# EAGLE design pcb (EAGLE 9.6.0)
Assembly variants: lowcost_cap, lowcost_battery
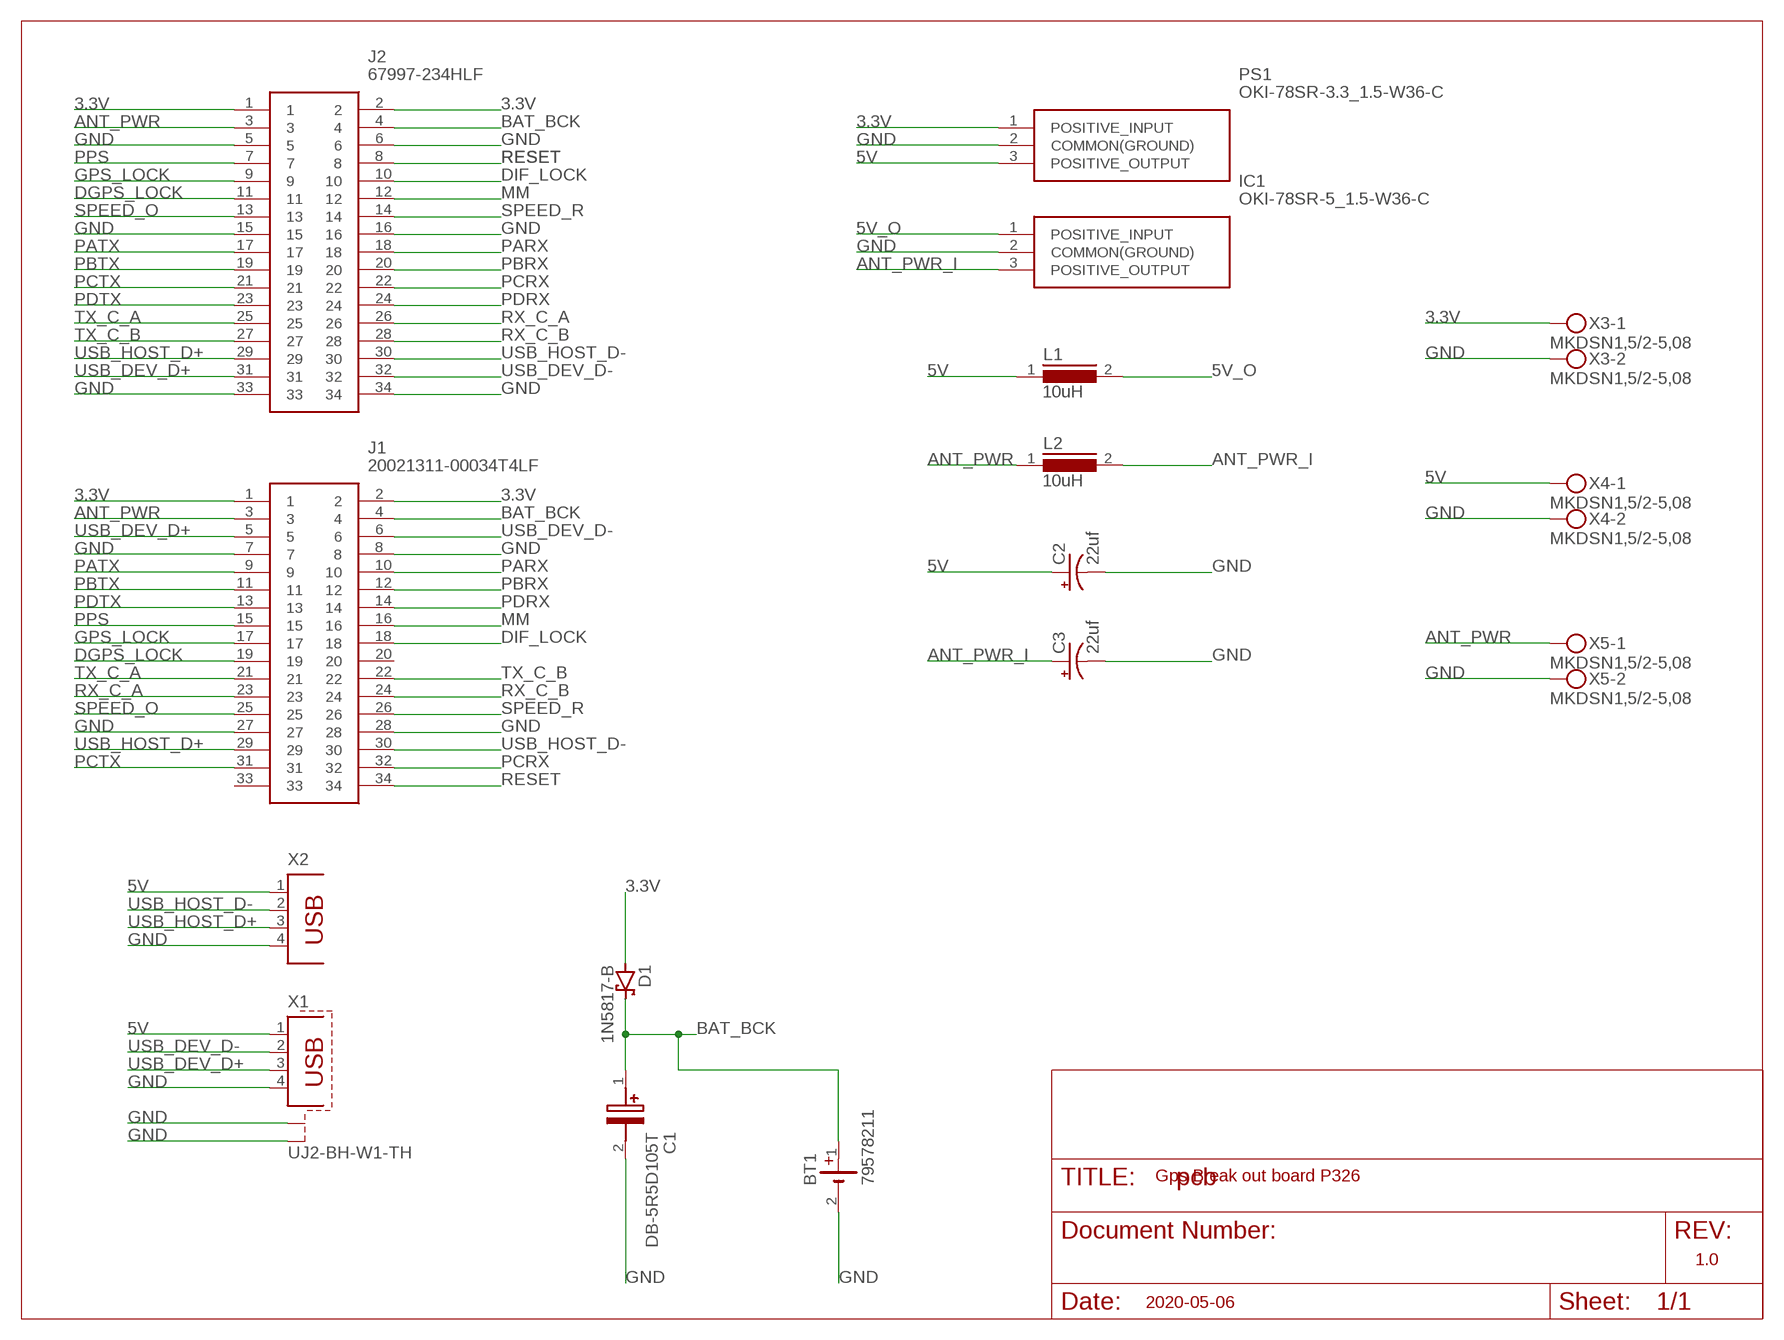
[diagram p0: schematic, sheet 1]

## Parts
BT1  79578211  [79578211]  (not fitted in variant lowcost_cap)
C1  DB-5R5D105T  [CAPPRD500W130D2150H800]  (not fitted in variant lowcost_battery)
C2  22uf  C-POL-US_RADIAL-11MM-DIA  [CAPPRD508W65D1000H1100B]  (not fitted in variant lowcost_cap)  (not fitted in variant lowcost_battery)
C3  22uf  C-POL-US_RADIAL-11MM-DIA  [CAPPRD508W65D1000H1100B]  (not fitted in variant lowcost_cap)  (not fitted in variant lowcost_battery)
D1  1N5817-B  [DO41-7.6]  (not fitted in variant lowcost_battery)
IC1  OKI-78SR-5_1.5-W36-C  [OKI-78SR]  (not fitted in variant lowcost_cap)  (not fitted in variant lowcost_battery)
J1  20021311-00034T4LF  SFMC-117-01-L-D-K  [SFMC11701LDK]
J2  67997-234HLF  TSW-117-07-L-D  [HDRV34W64P254_2X17_4318X495X83]
L1  10uH  82114R  [82114R]  (not fitted in variant lowcost_cap)  (not fitted in variant lowcost_battery)
L2  10uH  82114R  [82114R]  (not fitted in variant lowcost_cap)  (not fitted in variant lowcost_battery)
PS1  OKI-78SR-3.3_1.5-W36-C  OKI-78SR-5_1.5-W36-C  [OKI-78SR]  (not fitted in variant lowcost_cap)  (not fitted in variant lowcost_battery)
X1  UJ2-BH-W1-TH  PN61729-S  [PN61729-S]  (not fitted in variant lowcost_cap)  (not fitted in variant lowcost_battery)
X2  PN87520  [PN87520]  (not fitted in variant lowcost_cap)  (not fitted in variant lowcost_battery)
X3  MKDSN1,5/2-5,08  [MKDSN1,5/2-5,08]  (not fitted in variant lowcost_cap)  (not fitted in variant lowcost_battery)
X4  MKDSN1,5/2-5,08  [MKDSN1,5/2-5,08]  (not fitted in variant lowcost_cap)  (not fitted in variant lowcost_battery)
X5  MKDSN1,5/2-5,08  [MKDSN1,5/2-5,08]  (not fitted in variant lowcost_cap)  (not fitted in variant lowcost_battery)

## Nets
3.3V: D1.A J1.1 J1.2 J2.1 J2.2 PS1.1(POSITIVE_INPUT) X3.1
5V: C2.1(+) L1.1 PS1.3(POSITIVE_OUTPUT) X1.1 X2.1 X4.1
5V_O: IC1.1(POSITIVE_INPUT) L1.2
ANT_PWR: J1.3 J2.3 L2.1 X5.1
ANT_PWR_I: C3.1(+) IC1.3(POSITIVE_OUTPUT) L2.2
BAT_BCK: BT1.1(+) C1.1(+) D1.C J1.4 J2.4
DGPS_LOCK: J1.19 J2.11
DIF_LOCK: J1.18 J2.10
GND: BT1.2(-) C1.2(-) C2.2(-) C3.2(-) IC1.2(COMMON(GROUND)) J1.7 J1.8 J1.27 J1.28 J2.5 J2.6 J2.15 J2.16 J2.33 J2.34 PS1.2(COMMON(GROUND)) X1.4 X1.S1 X1.S2 X2.4 X3.2 X4.2 X5.2
GPS_LOCK: J1.17 J2.9
MM: J1.16 J2.12
PARX: J1.10 J2.18
PATX: J1.9 J2.17
PBRX: J1.12 J2.20
PBTX: J1.11 J2.19
PCRX: J1.32 J2.22
PCTX: J1.31 J2.21
PDRX: J1.14 J2.24
PDTX: J1.13 J2.23
PPS: J1.15 J2.7
RESET: J1.34 J2.8
RX_C_A: J1.23 J2.26
RX_C_B: J1.24 J2.28
SPEED_O: J1.25 J2.13
SPEED_R: J1.26 J2.14
TX_C_A: J1.21 J2.25
TX_C_B: J1.22 J2.27
USB_DEV_D+: J1.5 J2.31 X1.3
USB_DEV_D-: J1.6 J2.32 X1.2
USB_HOST_D+: J1.29 J2.29 X2.3
USB_HOST_D-: J1.30 J2.30 X2.2
Unconnected: J1.20 J1.33

## Notes on the sheet
- Gps Break out board P326
- 1.0
- 2020-05-06

## Library data of the parts
BT1 = Battery Holder:79578211: BATTERY HOLDER COIN PC PIN Manufacturer's datasheet <https://katalog.we-online.de/em/datasheet/79578211.pdf>; CREATED_BY: PCBLayout.com; DIGIKEY_PART_NO: 732-12330-ND; MANUFACTURER: Wurth Electronics Inc.; MPN: 79578211
C1 = DB-5R5D105T:DB-5R5D105T: Supercapacitors / Ultracapacitors MEM CAP 5.5V 1.0F Source: Datasheet <http://www.mouser.com/datasheet/2/129/DB_DBNe-3084.pdf>; DESCRIPTION: Supercapacitors / Ultracapacitors MEM CAP 5.5V 1.0F; HEIGHT: 8mm; MANUFACTURER_NAME: Elna; MANUFACTURER_PART_NUMBER: DB-5R5D105T; MOUSER_PART_NUMBER: 555-DB-5R5D105T; MOUSER_PRICE-STOCK: https://www.mouser.co.uk/ProductDetail/Elna/DB-5R5D105T?qs=r8OyiFxb6Rcu1BWmqcONIQ%3D%3D
C2 C3 = Capacitor:C-POL-US: Capacitor Polarised - ANSI; CATEGORY: Capacitor
D1 = diode:1N581*: 1.0A SCHOTTKY BARRIER RECTIFIER Source: http://www.diodes.com/datasheets/ds23001.pdf
IC1 PS1 = OKI-78SR-5_1.5-W36-C:OKI-78SR-5_1.5-W36-C: Non-Isolated DC/DC Converters 7.5W 24Vin 5Vout1 1.5A SIP Non-Iso Source: Datasheet <http://docs-emea.rs-online.com/webdocs/13d7/0900766b813d7b66.pdf>; DESCRIPTION: Non-Isolated DC/DC Converters 7.5W 24Vin 5Vout1 1.5A SIP Non-Iso; HEIGHT: mm; MANUFACTURER_NAME: Murata Electronics; MANUFACTURER_PART_NUMBER: OKI-78SR-5/1.5-W36-C; MOUSER_PART_NUMBER: 580-OKI78SR5/1.5W36C; MOUSER_PRICE-STOCK: https://www.mouser.co.uk/ProductDetail/Murata-Power-Solutions/OKI-78SR-5-15-W36-C?qs=uJpRT2lXVNXJP%252Bo08dQqJQ%3D%3D; RS_PART_NUMBER: 7962132P; RS_PRICE-STOCK: http://uk.rs-online.com/web/p/products/7962132P
J1 = SFMC-117-01-L-D-K:SFMC-117-01-L-D-K: .050" Tiger Eye High-Reliability Flexible Pin Count Socket Strip, 2x positions Source: Datasheet <https://au.mouser.com/ProductDetail/Samtec/SFMC-117-01-L-D-K?qs=PB6/jmICvI0qEg9HcYnQkA==>; DESCRIPTION: .050" Tiger Eye High-Reliability Flexible Pin Count Socket Strip, 2x positions; HEIGHT: 4.57mm; MANUFACTURER_NAME: Amphenol ICC (FCI); MANUFACTURER_PART_NUMBER: 20021311-00034T4LF; MOUSER_PART_NUMBER: 649-221311-00034T4LF; MOUSER_PRICE-STOCK: https://www.mouser.ca/ProductDetail/Amphenol-FCI/20021311-00034T4LF?qs=%2Fha2pyFaduhY7txd7xCZH4MnoZVHG9D20IyDq2KsCOnVLlItFYWmroWGFWusbTUh
J2 = TSW-117-07-L-D:TSW-117-07-L-D: Samtec TSW, 2.54mm Pitch, 34 Way, 2 Row PCB Terminal Block Header, Through Hole Source: Datasheet <http://suddendocs.samtec.com/catalog_english/tsw_th.pdf>; DESCRIPTION: Samtec TSW, 2.54mm Pitch, 34 Way, 2 Row PCB Terminal Block Header, Through Hole; HEIGHT: 8.38mm; MANUFACTURER_NAME: Amphenol ICC (FCI); MANUFACTURER_PART_NUMBER: 67997-234HLF; MOUSER_PART_NUMBER: 649-67997-234HLF; MOUSER_PRICE-STOCK: https://www.mouser.ca/ProductDetail/Amphenol-FCI/67997-234HLF?qs=%2Fha2pyFaduho4QXapRmeXGuJyHmXXipd3LGGQJh2eTsVKLqIuO2D5A%3D%3D; RS_PART_NUMBER: 1802714P; RS_PRICE-STOCK: http://uk.rs-online.com/web/p/products/1802714P
L1 L2 = inductors:82114R: INDUCTOR; SPICEPREFIX: L
X1 = con-berg:PN61729-S: BERG USB connector; OC_FARNELL: unknown; OC_NEWARK: unknown
X2 = con-berg:PN87520: BERG USB connector; OC_FARNELL: unknown; OC_NEWARK: unknown
X3-X5 = con-phoenix-508:MKDSN1,5/2-5,08: MKDSN 1,5/ 2-5,08 Printklemme Nennstrom: 13,5 A Nennspannung: 250 V Rastermaß: 5,08 mm Polzahl: 2 Anschlussart: Schraubanschluss Montage: Löten Anschlussrichtung Leiter/Platine: 0 ° Artikelnummer: 1729128 Source: http://eshop.phoenixcontact.com .. 1729128.pdf

## Board
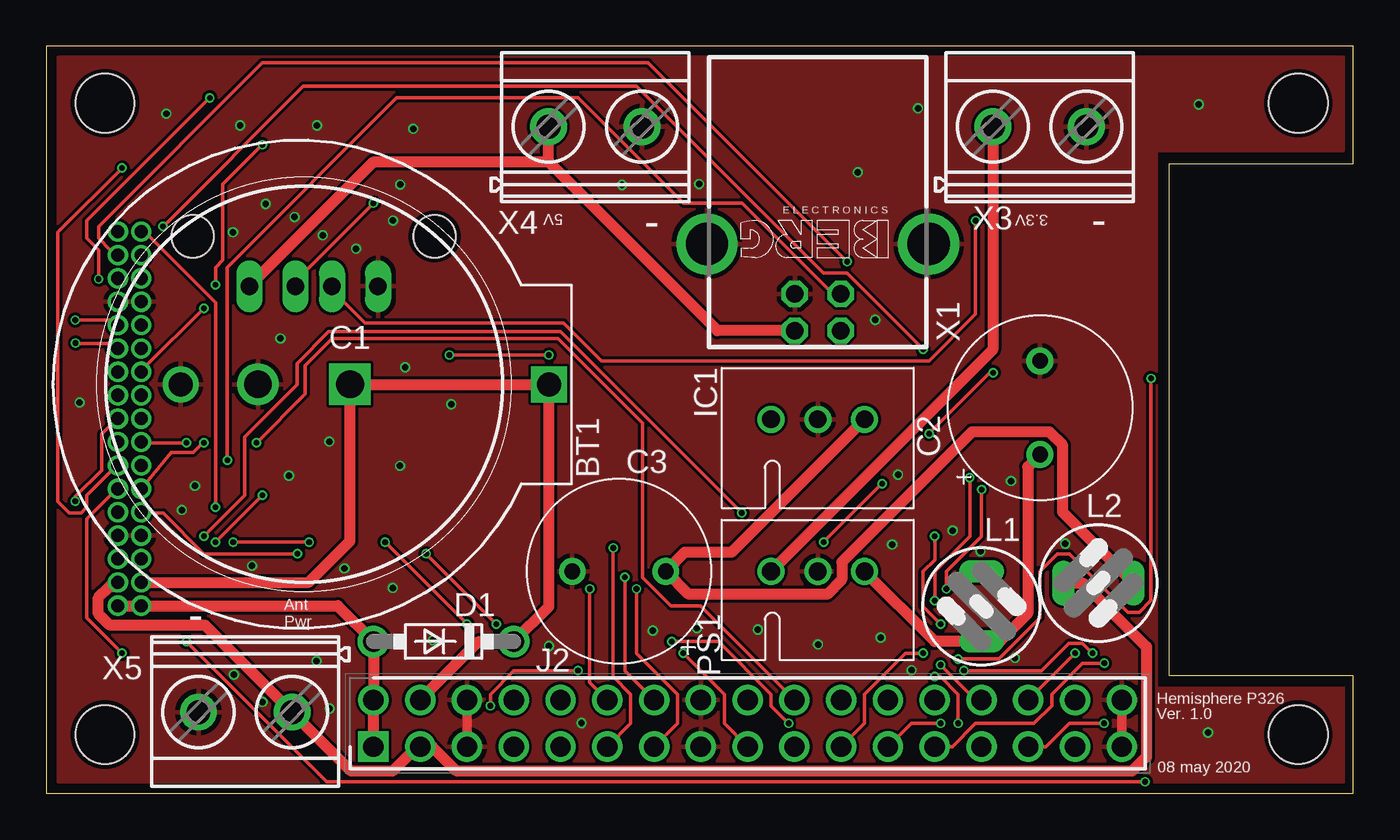
[diagram p1: board, top side]
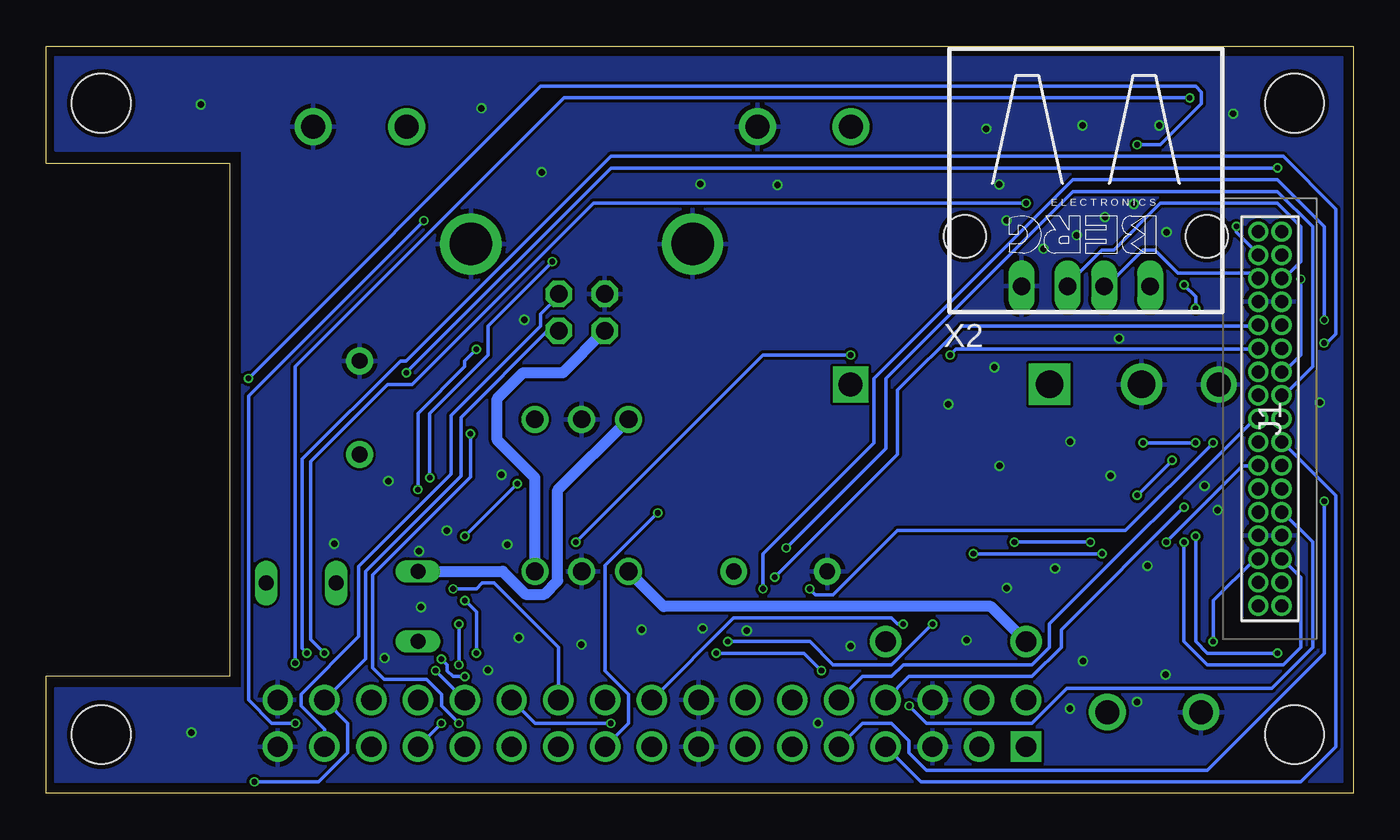
[diagram p2: board, bottom side, seen from below]

Size 71 x 40.6 mm. Coordinates in mm from the lower left corner, seen from the top.
Outline: 0,0 71,0 71,6.4 61,6.4 61,34.2 71,34.2 71,40.6 0,40.6 0,0
Copper layers (1*2*15*16): Top 0.035mm / dielectric 0.2mm / Route2 0.0175mm / dielectric 0.3mm / Route15 0.0175mm / dielectric 0.2mm / Bottom 0.035mm
Design rules "SeeedStudio_4layer_DRU_no_angle_20140221 *": minimum track width 8mil, minimum drill 12mil, track to track 6mil, track to pad 6mil, pad to pad 6mil, via to via 6mil, smd to smd 0mil, copper to edge 10mil, drill to drill 8mil, minimum pad ring 6mil, minimum via ring 4mil, stop-mask expansion 4mil, vias tented up to drill 25mil, thermal gap 10mil
Holes 3.2 mm at 3.2,37.5 3.2,3.2 68,3.2 68,37.5

### Footprints (pad centres in the part's own frame; a part is rotated, then mirrored left to right if it is on the bottom)
79578211 = drill 1.3 square: 1 0,0 | drill 1.3: 2 20,0
CAPPRD500W130D2150H800 = drill 1.5 pad 2.25 square: 1 0,0 | drill 1.5 pad 2.25: 2 5,0
CAPPRD508W65D1000H1100B = drill 0.85 pad 1.45: 1 -2.54,0; 2 2.54,0
DO41-7.6 = drill 1.1 pad 1.7: A 3.81,0; C -3.81,0
OKI-78SR = drill 0.96 pad 1.46: 1 0,0; 2 2.54,0; 3 5.08,0
SFMC11701LDK = drill 0.71 pad 1.1: 1 0,0; 2 0,1.27; 3 1.27,0; 4 1.27,1.27; 5 2.54,0; 6 2.54,1.27; 7 3.81,0; 8 3.81,1.27; 9 5.08,0; 10 5.08,1.27; 11 6.35,0; 12 6.35,1.27; 13 7.62,0; 14 7.62,1.27; 15 8.89,0; 16 8.89,1.27; 17 10.16,0; 18 10.16,1.27; 19 11.43,0; 20 11.43,1.27; 21 12.7,0; 22 12.7,1.27; 23 13.97,0; 24 13.97,1.27; 25 15.24,0; 26 15.24,1.27; 27 16.51,0; 28 16.51,1.27; 29 17.78,0; 30 17.78,1.27; 31 19.05,0; 32 19.05,1.27; 33 20.32,0; 34 20.32,1.27
HDRV34W64P254_2X17_4318X495X83 = drill 1.1 pad 1.65 square: 1 0,0 | drill 1.1 pad 1.65: 2 0,2.54; 3 2.54,0; 4 2.54,2.54; 5 5.08,0; 6 5.08,2.54; 7 7.62,0; 8 7.62,2.54; 9 10.16,0; 10 10.16,2.54; 11 12.7,0; 12 12.7,2.54; 13 15.24,0; 14 15.24,2.54; 15 17.78,0; 16 17.78,2.54; 17 20.32,0; 18 20.32,2.54; 19 22.86,0; 20 22.86,2.54; 21 25.4,0; 22 25.4,2.54; 23 27.94,0; 24 27.94,2.54; 25 30.48,0; 26 30.48,2.54; 27 33.02,0; 28 33.02,2.54; 29 35.56,0; 30 35.56,2.54; 31 38.1,0; 32 38.1,2.54; 33 40.64,0; 34 40.64,2.54
82114R = drill 0.813 long: 1 0,1.905; 2 0,-1.905
PN61729-S = drill 0.95 octagon: 1 1.25,4.71; 2 -1.25,4.71; 3 -1.25,2.71; 4 1.25,2.71 | drill 2.3 pad 2.9: S1 -6.02,0; S2 6.02,0
PN87520 = drill 0.95 long: 1 -3.5,2.71; 2 -1,2.71; 3 1,2.71; 4 3.5,2.71 | hole 2.3: -6.57,0; 6.57,0
MKDSN1,5/2-5,08 = drill 1.3 pad 2: 1 -2.561,0.025; 2 2.519,0.025

### Placement (x,y rotation side)
BT1  27.3,22.23 180 top
C1  16.51,22.23 180 top
C2  53.98,20.95 90 top
C3  31.11,12.06 180 top
D1  21.59,8.26 180 top
IC1  39.37,20.32 0 top
J1  3.9,10.2 90 bottom
J2  17.78,2.54 0 top
L1  50.8,10.16 180 top
L2  57.15,11.43 90 top
PS1  39.37,12.06 0 top
X1  41.91,29.84 180 top
X2  14.53,30.26 180 bottom
X3  53.98,36.2 0 top
X4  29.84,36.2 0 top
X5  10.79,4.45 180 top

### Tracks (layer width: path | path; a pad name or v marks a point on that pad's centre or on a via)
3.3V
  Top 0.61: J2.1 J2.2 D1.A 15.84,10.2 J1.2 J1.1 | X3.1 51.41,24.11 PS1.1
  Bottom 0.61: D1.A 19.68,10.16 37.47,10.16 PS1.1
5V
  Top 0.61: C2.1 53.31,17.75 53.31,9.78 51.79,8.26 L1.1 48.26,8.26 PS1.3 | X1.1 36.46,25.14 27.28,34.31 | 27.28,34.31 X4.1 | X2.1 17.79,34.31 27.28,34.31
  Bottom 0.61: PS1.3 44.45,17.14 46.5,19.19 46.5,21.45 45.09,22.86 42.94,22.86 X1.1
5V_O
  Bottom 0.61: IC1.1 43.21,16.48 43.21,11.55 43.94,10.83 44.96,10.83 46.2,12.06 L1.2
ANT_PWR
  Top 0.61: J1.3 3.69,11.26 3.46,11.26 2.84,10.64 2.84,9.76 3.46,9.14 8.63,9.14 X5.1 16.57,1.21 18.82,1.21 20.15,2.54 J2.3 20.98,2.54 22.31,1.21 58.97,1.21 59.75,1.99 59.75,7.97 56.3,11.43 L2.1
ANT_PWR_I
  Top 0.61: IC1.3 37.24,13.11 34.7,13.11 C3.1 34.89,10.83 42.42,10.83 43.21,11.62 43.21,12.58 50.28,19.65 54.49,19.65 55.21,18.93 55.21,15.28 L2.2
BAT_BCK
  Top 0.61: J2.4 23.5,8.26 D1.C 27.3,10.16 BT1.1 C1.1 16.51,13.71 14.27,11.47 J1.4
DGPS_LOCK  (via drill 0.3)
  Top 0.203: v30.8,13.34 30.8,6.35 31.75,5.4 31.75,3.81 J2.11
  Bottom 0.203: v30.8,13.34 25.4,18.73 25.4,22.54 15.24,32.7 4.13,32.7 2.22,30.8 2.22,23.18 3.49,21.91 3.81,21.91 J1.19
DIF_LOCK
  Bottom 0.203: J2.10 26.67,6.35 25.08,6.35 24.45,6.99 17.46,6.99 16.51,7.94 16.51,9.21 5.4,20.32 J1.18
GND  (via drill 0.35)
  Top 0.508: J2.6 J2.5 | J2.34 J2.33
  other vias: 21.01,8.32 62.59,37.42 63.1,3.31 19.94,36.11 14.72,36.29 10.54,36.29 6.53,36.93 10.15,30.48 19.22,17.79 13.19,17.26 15.38,19.12 22,21.14 18.82,11.16 16.21,12.23 12.73,24.72 7.37,15.4 15.4,4.61 14.69,7.19 11.19,12.36 8.09,16.71 55.35,13.57 52.41,16.97 50.64,10.12 41.92,8.1 38.66,8.9 45.33,8.46 46.27,17.32 45.95,13.52 49.24,14.28 35.34,8.97 32.95,8.85 27.31,8.01 50.75,13.16 52.61,7.36 11.93,32.03 13.5,31.31 15.03,30.32 16.84,29.59 18.84,31.12 19.23,33.08 31.28,33.06 35.47,33.1 44.09,33.75 47.35,37.22 19.5,23.15 1.83,21.24 10.21,6.45 11.75,4.97 29.08,3.82 45.03,25.73 47,6.69
  pour Bottom: 0.64,40.01 0.64,0.64 70.48,0.64 70.48,5.71 60.33,5.71 60.33,34.92 70.48,34.92 70.48,40.01
  pour Top: 0.64,40.01 0.64,0.64 70.48,0.64 70.48,5.71 60.33,5.71 60.33,34.92 70.48,34.92 70.48,40.01
GPS_LOCK  (via drill 0.3)
  Top 0.203: v1.59,15.88 1.59,16.12 3.01,17.55 3.01,19.52 3.81,20.32 J1.17
  Bottom 0.203: v1.59,15.88 1.59,7.62 7.94,1.27 23.18,1.27 24.13,2.22 24.13,2.86 25.08,3.81 26.67,3.81 J2.9
MM  (via drill 0.3)
  Top 0.203: v7.62,19.05 5.4,19.05 J1.16 | v29.53,11.11 29.53,6.03 J2.12
  Bottom 0.203: v7.62,19.05 12.38,14.29 24.77,14.29 28.26,10.79 29.21,10.79 v29.53,11.11
PARX  (via drill 0.3)
  Top 0.203: v13.65,13.02 8.57,13.02 6.35,15.24 5.4,15.24 J1.10 | v24.45,9.21 v20.64,13.02
  Bottom 0.203: v20.64,13.02 v13.65,13.02 | v24.45,9.21 24.77,9.21 25.08,9.53 33.66,9.53 J2.18
PATX  (via drill 0.3)
  Top 0.203: v24.13,4.76 24.13,5.4 25.4,6.67 v28.89,6.67 | v34.61,7.62 36.83,5.4 36.83,3.81 J2.17
  Bottom 0.203: v24.13,4.76 23.18,3.81 17.46,3.81 15.56,5.71 4.45,5.71 2.22,7.94 2.22,13.65 3.81,15.24 J1.9 | v28.89,6.67 29.84,7.62 v34.61,7.62
PBRX  (via drill 0.3)
  Top 0.203: v8.57,19.05 8.51,19.05 7.99,18.53 6.8,18.53 J1.12 | v11.43,19.05 14.07,21.69 14.07,23.24 15.53,24.7 27.79,24.7 32.38,20.11 32.38,11.75 33.95,10.18 35.54,10.18 J2.20
  Bottom 0.203: v11.43,19.05 v8.57,19.05
PBTX  (via drill 0.3)
  Top 0.203: v4.13,7.62 2.22,9.53 2.22,14.92 3.81,16.51 J1.11 | v8.57,13.97 10.79,16.19 10.79,19.37 13.64,22.21 13.64,23.36 15.36,25.08 27.94,25.08 v37.78,15.24
  Bottom 0.203: v4.13,7.62 7.94,7.62 8.57,8.26 v8.57,13.97 | v37.78,15.24 40.64,12.38 40.64,6.67 39.37,5.4 39.37,3.81 J2.19
PCRX  (via drill 0.3)
  Top 0.203: v6.35,30.8 13.97,38.42 32.07,38.42 42.23,28.26 43.5,28.26 v47.62,24.13 | v50.8,16.51 50.8,13.97 48.9,12.06 v48.9,11.11
  Bottom 0.203: v6.35,30.8 6.35,30.48 5.4,29.53 J1.32 | v47.62,24.13 48.26,23.5 48.26,23.18 50.8,20.64 v50.8,16.51 | v48.9,11.11 47.62,11.11 47.31,11.43 46.67,11.43 43.18,7.94 J2.22
PCTX  (via drill 0.3)
  Top 0.203: v43.5,28.89 32.7,39.69 11.75,39.69 2.86,30.8 2.86,30.16 3.49,29.53 3.81,29.53 J1.31 | v50.16,17.14 50.16,13.97 48.26,12.06 v48.26,10.48 | v47.62,7.62 46.67,7.62 44.45,5.4 44.45,3.81 J2.21
  Bottom 0.203: v43.5,28.89 46.99,25.4 46.99,23.81 50.16,20.64 v50.16,17.14 | v48.26,10.48 48.25,10.48 47.62,9.85 v47.62,7.62
PDRX  (via drill 0.3)
  Top 0.203: v14.29,13.65 v10.16,13.65 | v22.86,9.21 v18.41,13.65 | v33.97,8.26 36.51,8.26 39.37,5.4 39.37,4.76 v40.32,3.81
  Bottom 0.203: v10.16,13.65 6.03,17.78 5.4,17.78 J1.14 | v18.41,13.65 v14.29,13.65 | v22.86,9.21 25.08,6.99 28.26,6.99 29.53,8.26 v33.97,8.26 | v40.32,3.81 44.45,3.81 J2.24
PDTX  (via drill 0.3)
  Top 0.203: v4.13,33.97 0.64,30.48 0.64,15.88 1.27,15.24 1.91,15.24 2.22,15.56 2.22,16.19 3.81,17.78 J1.13 | v51.44,22.86 51.27,22.86 v47.95,19.55 | v48.58,3.81 46.99,3.81 J2.23
  Bottom 0.203: v4.13,33.97 40.32,33.97 v51.44,22.86 | v47.95,19.55 47.95,17.2 53.27,11.88 53.27,6.83 52.64,6.2 50.33,6.2 49.53,5.4 49.53,4.76 v48.58,3.81
PPS
  Bottom 0.203: J2.7 23.5,0.64 2.86,0.64 0.95,2.54 0.95,16.19 3.81,19.05 J1.15
RESET  (via drill 0.3)
  Top 0.203: v9.21,15.56 9.21,26.67 5.4,30.48 J1.34
  Bottom 0.203: v9.21,15.56 15.88,8.89 15.88,7.94 17.46,6.35 24.13,6.35 J2.8
RX_C_A  (via drill 0.3)
  Top 0.203: v1.61,24.47 1.61,24.45 3.81,24.45 J1.23 | v56.83,7.62 56.29,8.16 55.56,8.16 54.06,6.67 v49.85,6.67
  Bottom 0.203: v1.61,24.47 1.44,24.47 0.95,24.96 0.95,31.75 3.81,34.61 40.32,34.61 51.44,23.5 51.75,23.5 57.08,18.17 57.08,7.87 v56.83,7.62 | J2.26 v49.85,6.67
RX_C_B  (via drill 0.3)
  Top 0.203: v27.3,23.81 v21.91,23.81 | v45.4,16.83 v42.23,13.65 | v48.26,13.97 48.26,12.7 47.62,12.06 47.62,10.16 v48.58,9.21 | v48.58,6.99 50.48,5.08 J2.28
  Bottom 0.203: v21.91,23.81 21.59,24.13 5.4,24.13 J1.24 | v27.3,23.81 32.07,23.81 v42.23,13.65 | v48.26,13.97 v45.4,16.83 | v48.58,6.99 v48.58,9.21
SPEED_O  (via drill 0.3)
  Top 0.203: v1.59,25.72 3.81,25.72 J1.25 | v32.07,11.11 32.07,7.62 34.29,5.4 34.29,3.81 J2.13
  Bottom 0.203: v1.59,25.72 1.59,30.8 4.13,33.34 15.24,33.34 26.04,22.54 26.04,19.05 32.07,13.02 v32.07,11.11
SPEED_R  (via drill 0.3)
  Top 0.203: v31.43,11.75 31.43,6.67 J2.14
  Bottom 0.203: v31.43,11.75 24.77,18.41 24.77,21.91 21.27,25.4 5.4,25.4 J1.26
TX_C_A  (via drill 0.3)
  Top 0.203: v2.86,27.94 2.86,29.53 2.22,30.16 2.22,31.11 v8.89,37.78 | v57.47,7.08 56.29,7.08 54.61,5.4 54.61,4.76 53.66,3.81 50.48,3.81 49.21,2.54 J2.25
  Bottom 0.203: v2.86,27.94 2.86,23.81 3.49,23.18 3.81,23.18 J1.21 | v8.89,37.78 42.86,37.78 57.47,23.18 v57.47,7.08
TX_C_B  (via drill 0.3)
  Top 0.203: v8.57,26.35 5.4,23.18 J1.22 | v9.21,27.62 9.21,28.57 9.59,28.96 9.59,33.09 v11.75,35.24 | v60.01,22.54 60.01,10.48 59.37,9.84 58.74,9.84 55.56,13.02 54.93,13.02 53.98,12.06 53.98,9.53 51.75,7.3 v49.53,7.3 | v48.26,6.35 48.58,6.35 49.53,5.4 v49.53,3.81
  Bottom 0.203: v8.57,26.35 8.57,26.99 v9.21,27.62 | v11.75,35.24 10.48,35.24 8.26,37.47 8.26,38.1 8.57,38.42 44.13,38.42 v60.01,22.54 | v49.53,7.3 49.21,6.99 49.21,6.67 48.9,6.35 v48.26,6.35 | J2.27 v49.53,3.81
USB_DEV_D+  (via drill 0.3)
  Top 0.203: v11.75,16.19 v9.21,13.65 | v9.84,18.1 9.84,28.57 19.05,37.78 28.89,37.78 34.61,32.07 37.78,32.07 42.86,26.99 X1.3
  Bottom 0.203: v9.21,13.65 9.21,8.26 7.94,6.99 3.81,6.99 2.86,7.94 2.86,11.75 3.81,12.7 J1.5 | v9.84,18.1 v11.75,16.19 | J2.31 55.88,3.49 57.15,4.76 57.15,5.4 54.02,8.53 54.02,12.34 48.99,17.37 48.99,20.54 44.13,25.4 44.13,26.04 43.18,26.99 X1.3
USB_DEV_D-  (via drill 0.3)
  Top 0.203: v7.62,8.26 15.24,0.64 v59.69,0.64
  Bottom 0.203: v7.62,8.26 7.62,10.48 5.4,12.7 J1.6 | v59.69,0.64 56.2,0.64 54.61,2.22 54.61,3.81 J2.32 53.66,7.3 53.66,12.06 48.47,17.25 48.47,20.43 43.81,25.08 43.18,25.08 X1.2
USB_HOST_D+  (via drill 0.3)
  Top 0.203: J2.29 54.29,2.54 55.56,3.81 v57.47,3.81 | v50.48,31.11 50.48,26.04 47.94,23.5 30.16,23.5 28.11,25.55 17.32,25.55 15.56,27.3 X2.3
  Bottom 0.203: J1.29 3.81,28.26 3.49,28.26 2.86,28.89 2.86,30.8 4.13,32.07 10.48,32.07 13.02,29.53 13.65,29.53 15.56,27.62 X2.3 | v57.47,3.81 58.74,3.81 60.01,5.08 60.01,21.59 v50.48,31.11
USB_HOST_D-  (via drill 0.3)
  Top 0.203: v55.88,7.62 J2.30 | v17.78,32.07 13.34,27.62 X2.2
  Bottom 0.203: J1.30 5.4,28.26 9.53,28.26 10.79,29.53 11.43,29.53 13.34,27.62 X2.2 | v55.88,7.62 56.64,8.38 56.64,18.03 52.44,22.23 51.12,22.23 41.27,32.07 v17.78,32.07

### Text on the board
tNames: - | - | 5V | 3.3V | - | Ant / Pwr | Hemisphere P326 | Ver. 1.0 | 08 may 2020